# EAGLE design weather-cube_piezo_overvoltage_protection (EAGLE 7.3.0)
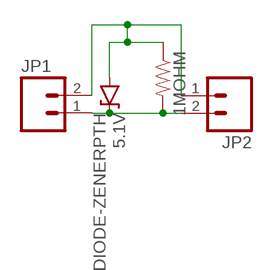
[diagram p0: schematic, sheet 1]

## Parts
1MOHM  RESISTORAXIAL-0.3  [AXIAL-0.3]
5.1V  DIODE-ZENERPTH  [DIODE-ZENER]
JP1  M02PTH  [1X02]
JP2  M02PTH  [1X02]

## Nets
GND: 1MOHM.P$1 5.1V.P$2(A) JP1.2 JP2.1
N$1: 1MOHM.P$2 5.1V.P$1(C) JP1.1 JP2.2

## Library data of the parts
1MOHM = SparkFun-Passives:RESISTOR: Resistor Basic schematic elements and footprints for 0603, 1206, and PTH resistors.
5.1V = SparkFun-DiscreteSemi:DIODE-ZENER: Zener Diode Production Part - 8199 3.4V Zener Voltage
JP1 JP2 = SparkFun-Connectors:M02: Standard 2-pin 0.1" header. Use with - straight break away headers ( PRT-00116) - right angle break away headers (PRT-00553) - swiss pins (PRT-00743) - machine pins (PRT-00117) - female headers (PRT-00115) Molex polarized connector foot print use with: PRT-08233 with associated crimp pins and housings. 2.54_SCREWTERM for use with PRT-10571. 3.5mm Screw Terminal footprints for PRT-08084 5mm Screw Terminal footprints for use with PRT-08432

## Board
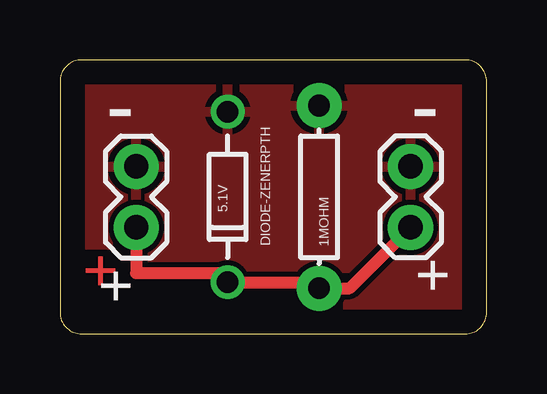
[diagram p1: board, top side]
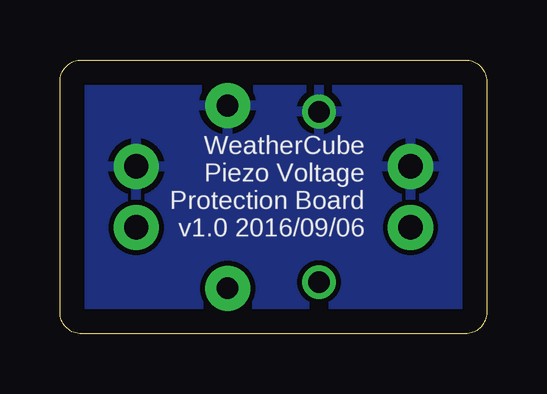
[diagram p2: board, bottom side, seen from below]

Size 17.78 x 11.43 mm. Coordinates in mm from the lower left corner, seen from the top.
Outline: 0,10.53 0,0.9 arc90 0.9,0 16.88,0 arc90 17.78,0.9 17.78,10.53 arc90 16.88,11.43 0.9,11.43 arc90 0,10.53
Copper layers (1*16): Top 0.035mm / dielectric 1.5mm / Bottom 0.035mm
Design rules "default": minimum track width 10mil, minimum drill 24mil, track to track 8mil, track to pad 8mil, pad to pad 8mil, via to via 8mil, smd to smd 8mil, copper to edge 40mil, drill to drill 8mil, minimum pad ring 10mil, minimum via ring 8mil, stop-mask expansion 4mil, vias tented up to drill 0mil, thermal gap 10mil

### Footprints (pad centres in the part's own frame; a part is rotated, then mirrored left to right if it is on the bottom)
AXIAL-0.3 = drill 0.9 pad 1.88: P$1 -3.81,0; P$2 3.81,0
DIODE-ZENER = drill 0.9: P$1 -3.556,0; P$2 3.556,0
1X02 = drill 1.016 pad 1.88: 1 0,0; 2 2.54,0

### Placement (x,y rotation side)
1MOHM  10.79,5.71 270 top
5.1V  6.98,5.71 90 top
JP1  3.17,4.45 90 top
JP2  14.61,6.99 270 top

### Tracks (layer width: path | path; a pad name or v marks a point on that pad's centre or on a via)
GND
  pour Top: -5.08,15.88 25.4,15.88 25.4,-5.08 -5.08,-5.08
  pour Bottom: -2.54,13.34 21.59,13.34 21.59,-2.54 -2.54,-2.54
N$1
  Top 0.508: JP1.1 3.17,2.54 6.6,2.54 5.1V.P$1 10.54,2.16 1MOHM.P$2 12.06,1.91 JP2.2

### Text on the board
Top: + | + | + | +
tPlace: - | - | + | +
bPlace: WeatherCube / Piezo Voltage / Protection Board / v1.0 2016/09/06